# Altium schematic sheet CM4.SchDoc
size A3; SheetNumber: 3; SheetTotal: 10
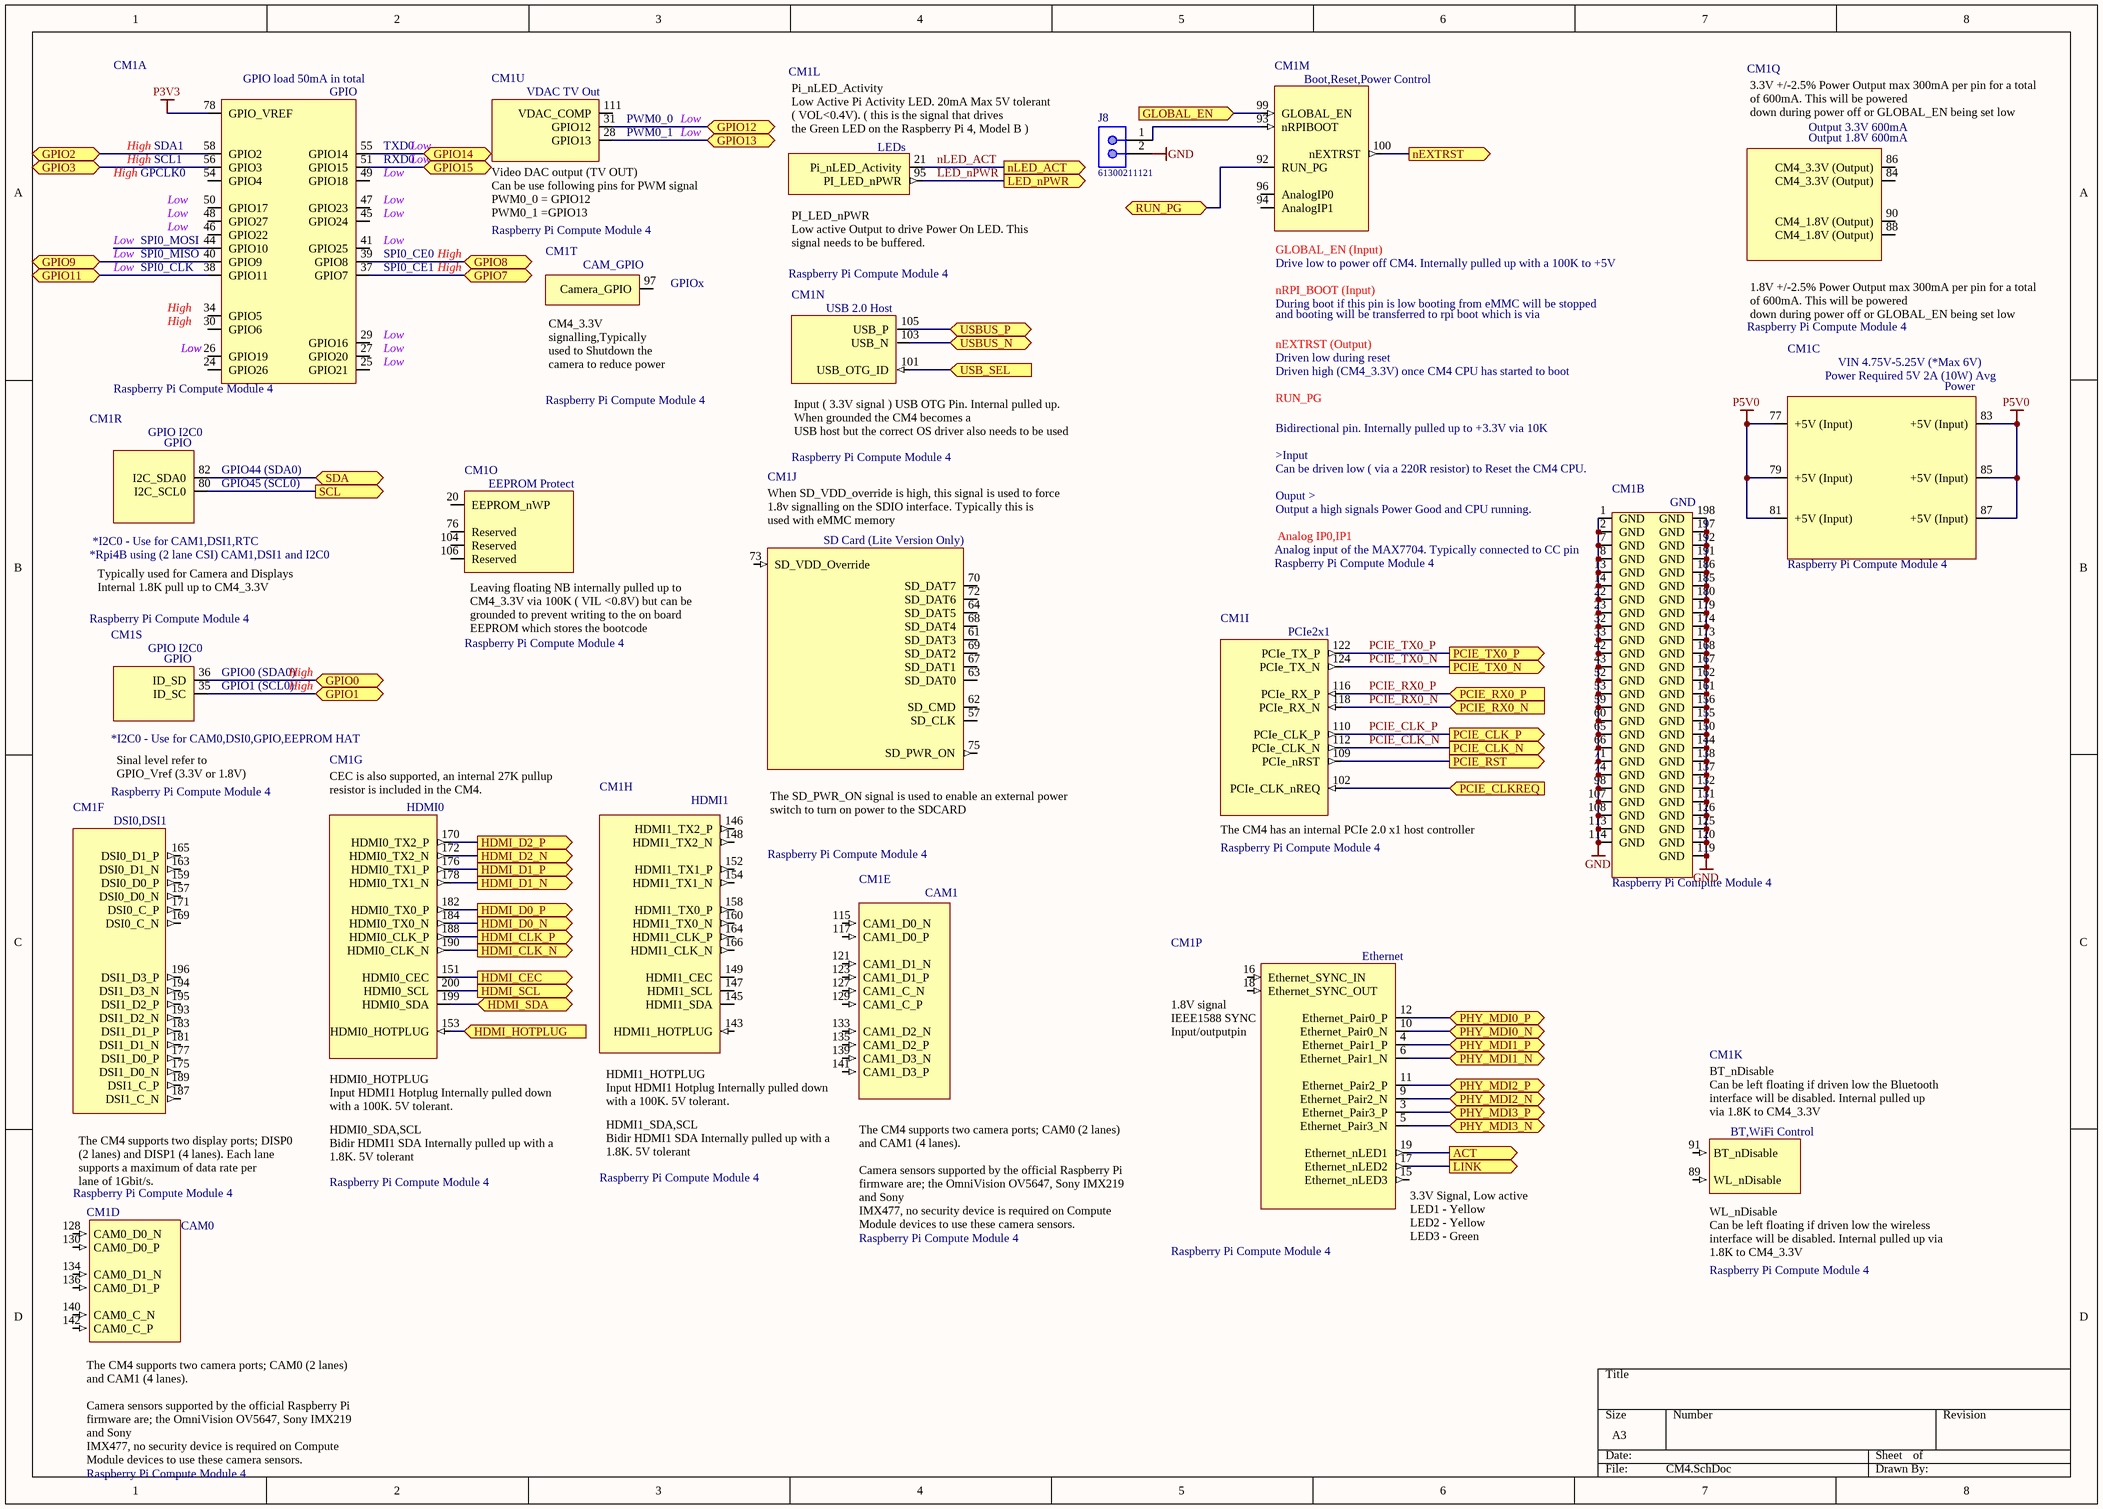
[diagram p0: CM4.SchDoc]

## Parts
CM1  Raspberry Pi Compute Module 4  [CM4-DF40HC(3.0)-100DS-0.4v_3mm_1.5mm]  (parts A,B,C,D,E,F,G,H,I,J,K,L,M,N,O,P,Q,R,S,T,U of 21)  (no BOM)
J8  61300211121  [61300211121]

## Ports
ACT (out), GLOBAL_EN (in), GPIO0 (bidir), GPIO1 (bidir), GPIO2 (bidir), GPIO3 (bidir), GPIO7 (bidir), GPIO8 (bidir), GPIO9 (bidir), GPIO11 (bidir), GPIO12 (bidir), GPIO13 (bidir), GPIO14 (bidir), GPIO15 (bidir), HDMI_CEC (out), HDMI_CLK_N (out), HDMI_CLK_P (out), HDMI_D0_N (out), HDMI_D0_P (out), HDMI_D1_N (out), HDMI_D1_P (out), HDMI_D2_N (out), HDMI_D2_P (out), HDMI_HOTPLUG (in), HDMI_SCL (out), HDMI_SDA (bidir), LED_nPWR (out), LINK (out), nEXTRST (out), nLED_ACT (out), PCIE_CLK_N (out), PCIE_CLK_P (out), PCIE_CLKREQ (in), PCIE_RST (out), PCIE_RX0_N (in), PCIE_RX0_P (in), PCIE_TX0_N (out), PCIE_TX0_P (out), PHY_MDI0_N (bidir), PHY_MDI0_P (bidir), PHY_MDI1_N (bidir), PHY_MDI1_P (bidir), PHY_MDI2_N (bidir), PHY_MDI2_P (bidir), PHY_MDI3_N (bidir), PHY_MDI3_P (bidir), RUN_PG (bidir), SCL (out), SDA (bidir), USB_SEL (in), USBUS_N (bidir), USBUS_P (bidir)

## Nets
GND: CM1.1(GND) CM1.2(GND) CM1.7(GND) CM1.8(GND) CM1.13(GND) CM1.14(GND) CM1.22(GND) CM1.23(GND) CM1.32(GND) CM1.33(GND) CM1.42(GND) CM1.43(GND) CM1.52(GND) CM1.53(GND) CM1.59(GND) CM1.60(GND) CM1.65(GND) CM1.66(GND) CM1.71(GND) CM1.74(GND) CM1.98(GND) CM1.107(GND) CM1.108(GND) CM1.113(GND) CM1.114(GND) CM1.119(GND) CM1.120(GND) CM1.125(GND) CM1.126(GND) CM1.131(GND) CM1.132(GND) CM1.137(GND) CM1.138(GND) CM1.144(GND) CM1.150(GND) CM1.155(GND) CM1.156(GND) CM1.161(GND) CM1.162(GND) CM1.167(GND) CM1.168(GND) CM1.173(GND) CM1.174(GND) CM1.179(GND) CM1.180(GND) CM1.185(GND) CM1.186(GND) CM1.191(GND) CM1.192(GND) CM1.197(GND) CM1.198(GND) J8.2
P3V3: CM1.78(GPIO_VREF)
P5V0: CM1.77(+5V_(Input)) CM1.79(+5V_(Input)) CM1.81(+5V_(Input)) CM1.83(+5V_(Input)) CM1.85(+5V_(Input)) CM1.87(+5V_(Input))
ACT: CM1.19(Ethernet_nLED1) ; port ACT
GLOBAL_EN: CM1.99(GLOBAL_EN) ; port GLOBAL_EN
GPIO0: CM1.36(ID_SD) ; port GPIO0
GPIO1: CM1.35(ID_SC) ; port GPIO1
GPIO2: CM1.58(GPIO2) ; port GPIO2
GPIO3: CM1.56(GPIO3) ; port GPIO3
GPIO7: CM1.37(GPIO7) ; port GPIO7
GPIO8: CM1.39(GPIO8) ; port GPIO8
GPIO9: CM1.40(GPIO9) ; port GPIO9
GPIO11: CM1.38(GPIO11) ; port GPIO11
GPIO12: CM1.31(GPIO12) ; port GPIO12
GPIO13: CM1.28(GPIO13) ; port GPIO13
GPIO14: CM1.55(GPIO14) ; port GPIO14
GPIO15: CM1.51(GPIO15) ; port GPIO15
HDMI_CEC: CM1.151(HDMI0_CEC) ; port HDMI_CEC
HDMI_CLK_N: CM1.190(HDMI0_CLK_N) ; port HDMI_CLK_N
HDMI_CLK_P: CM1.188(HDMI0_CLK_P) ; port HDMI_CLK_P
HDMI_D0_N: CM1.184(HDMI0_TX0_N) ; port HDMI_D0_N
HDMI_D0_P: CM1.182(HDMI0_TX0_P) ; port HDMI_D0_P
HDMI_D1_N: CM1.178(HDMI0_TX1_N) ; port HDMI_D1_N
HDMI_D1_P: CM1.176(HDMI0_TX1_P) ; port HDMI_D1_P
HDMI_D2_N: CM1.172(HDMI0_TX2_N) ; port HDMI_D2_N
HDMI_D2_P: CM1.170(HDMI0_TX2_P) ; port HDMI_D2_P
HDMI_HOTPLUG: CM1.153(HDMI0_HOTPLUG) ; port HDMI_HOTPLUG
HDMI_SCL: CM1.200(HDMI0_SCL) ; port HDMI_SCL
HDMI_SDA: CM1.199(HDMI0_SDA) ; port HDMI_SDA
LED_nPWR: CM1.95(PI_LED_nPWR) ; port LED_nPWR
LINK: CM1.17(Ethernet_nLED2) ; port LINK
nEXTRST: CM1.100(nEXTRST) ; port nEXTRST
nLED_ACT: CM1.21(Pi_nLED_Activity) ; port nLED_ACT
PCIE_CLK_N: CM1.112(PCIe_CLK_N) ; port PCIE_CLK_N
PCIE_CLK_P: CM1.110(PCIe_CLK_P) ; port PCIE_CLK_P
PCIE_CLKREQ: CM1.102(PCIe_CLK_nREQ) ; port PCIE_CLKREQ
PCIE_RST: CM1.109(PCIe_nRST) ; port PCIE_RST
PCIE_RX0_N: CM1.118(PCIe_RX_N) ; port PCIE_RX0_N
PCIE_RX0_P: CM1.116(PCIe_RX_P) ; port PCIE_RX0_P
PCIE_TX0_N: CM1.124(PCIe_TX_N) ; port PCIE_TX0_N
PCIE_TX0_P: CM1.122(PCIe_TX_P) ; port PCIE_TX0_P
PHY_MDI0_N: CM1.10(Ethernet_Pair0_N) ; port PHY_MDI0_N
PHY_MDI0_P: CM1.12(Ethernet_Pair0_P) ; port PHY_MDI0_P
PHY_MDI1_N: CM1.6(Ethernet_Pair1_N) ; port PHY_MDI1_N
PHY_MDI1_P: CM1.4(Ethernet_Pair1_P) ; port PHY_MDI1_P
PHY_MDI2_N: CM1.9(Ethernet_Pair2_N) ; port PHY_MDI2_N
PHY_MDI2_P: CM1.11(Ethernet_Pair2_P) ; port PHY_MDI2_P
PHY_MDI3_N: CM1.5(Ethernet_Pair3_N) ; port PHY_MDI3_N
PHY_MDI3_P: CM1.3(Ethernet_Pair3_P) ; port PHY_MDI3_P
RUN_PG: CM1.92(RUN_PG) ; port RUN_PG
SCL: CM1.80(I2C_SCL0) ; port SCL
SDA: CM1.82(I2C_SDA0) ; port SDA
USB_SEL: CM1.101(USB_OTG_ID) ; port USB_SEL
USBUS_N: CM1.103(USB_N) ; port USBUS_N
USBUS_P: CM1.105(USB_P) ; port USBUS_P
NetCM1_93: CM1.93(nRPIBOOT) J8.1

Not connected (* = marked no-connect by the designer): CM1 15(Ethernet_nLED3) 16(Ethernet_SYNC_IN) 18(Ethernet_SYNC_OUT) 20(EEPROM_nWP) 24(GPIO26) 25(GPIO21) 26(GPIO19) 27(GPIO20) 29(GPIO16) 30(GPIO6) 34(GPIO5) 41(GPIO25) 44(GPIO10) 45(GPIO24) 46(GPIO22) 47(GPIO23) 48(GPIO27) 49(GPIO18) 50(GPIO17) 54(GPIO4) 57(SD_CLK) 61(SD_DAT3) 62(SD_CMD) 63(SD_DAT0) 64(SD_DAT5) 67(SD_DAT1) 68(SD_DAT4) 69(SD_DAT2) 70(SD_DAT7) 72(SD_DAT6) 73(SD_VDD_Override) 75(SD_PWR_ON) 76(Reserved) 84(CM4_3.3V_(Output)) 86(CM4_3.3V_(Output)) 88(CM4_1.8V_(Output)) 89(WL_nDisable) 90(CM4_1.8V_(Output)) 91(BT_nDisable) 94(AnalogIP1) 96(AnalogIP0) 97(Camera_GPIO) 104(Reserved) 106(Reserved) 111(VDAC_COMP) 115(CAM1_D0_N) 117(CAM1_D0_P) 121(CAM1_D1_N) 123(CAM1_D1_P) 127(CAM1_C_N) 128(CAM0_D0_N) 129(CAM1_C_P) 130(CAM0_D0_P) 133(CAM1_D2_N) 134(CAM0_D1_N) 135(CAM1_D2_P) 136(CAM0_D1_P) 139(CAM1_D3_N) 140(CAM0_C_N) 141(CAM1_D3_P) 142(CAM0_C_P) 143(HDMI1_HOTPLUG) 145(HDMI1_SDA) 146(HDMI1_TX2_P) 147(HDMI1_SCL) 148(HDMI1_TX2_N) 149(HDMI1_CEC) 152(HDMI1_TX1_P) 154(HDMI1_TX1_N) 157(DSI0_D0_N) 158(HDMI1_TX0_P) 159(DSI0_D0_P) 160(HDMI1_TX0_N) 163(DSI0_D1_N) 164(HDMI1_CLK_P) 165(DSI0_D1_P) 166(HDMI1_CLK_N) 169(DSI0_C_N) 171(DSI0_C_P) 175(DSI1_D0_N) 177(DSI1_D0_P) 181(DSI1_D1_N) 183(DSI1_D1_P) 187(DSI1_C_N) 189(DSI1_C_P) 193(DSI1_D2_N) 194(DSI1_D3_N) 195(DSI1_D2_P) 196(DSI1_D3_P)

## Notes on the sheet
- (in symbol CM4, part A) GPIO load 50mA in total; GPIO; High; SDA1; TXD0; Low; SCL1; RXD0; GPCLK0; SPI0_MOSI; SPI0_MISO; SPI0_CE0; SPI0_CLK; SPI0_CE1; by Amornthep Phunsin
- (in symbol CM4, part C) VIN 4.75V-5.25V (*Max 6V); Power Required 5V 2A (10W) Avg; Power; by Amornthep Phunsin
- (in symbol CM4, part D) CAM0; The CM4 supports two camera ports; CAM0 (2 lanes) and CAM1 (4 lanes). / Camera sensors supported by the official Raspberry Pi firmware are; the OmniVision OV5647, Sony IMX219 and Sony / IMX477, no security device is required on Compute Module devices to use these camera sensors.
- (in symbol CM4, part E) CAM1; The CM4 supports two camera ports; CAM0 (2 lanes) and CAM1 (4 lanes). / Camera sensors supported by the official Raspberry Pi firmware are; the OmniVision OV5647, Sony IMX219 and Sony / IMX477, no security device is required on Compute Module devices to use these camera sensors.
- (in symbol CM4, part F) DSI0,DSI1; The CM4 supports two display ports; DISP0 (2 lanes) and DISP1 (4 lanes). Each lane supports a maximum of data rate per / lane of 1Gbit/s.
- (in symbol CM4, part G) HDMI0; CEC is also supported, an internal 27K pullup resistor is included in the CM4.; HDMI0_HOTPLUG / Input HDMI1 Hotplug Internally pulled down with a 100K. 5V tolerant.; HDMI0_SDA,SCL / Bidir HDMI1 SDA Internally pulled up with a 1.8K. 5V tolerant
- (in symbol CM4, part H) HDMI1; HDMI1_HOTPLUG / Input HDMI1 Hotplug Internally pulled down with a 100K. 5V tolerant.; HDMI1_SDA,SCL / Bidir HDMI1 SDA Internally pulled up with a 1.8K. 5V tolerant
- (in symbol CM4, part I) PCIe2x1; The CM4 has an internal PCIe 2.0 x1 host controller
- (in symbol CM4, part J) When SD_VDD_override is high, this signal is used to force 1.8v signalling on the SDIO interface. Typically this is / used with eMMC memory; SD Card (Lite Version Only); by Amornthep Phunsin; The SD_PWR_ON signal is used to enable an external power switch to turn on power to the SDCARD
- (in symbol CM4, part K) BT_nDisable / Can be left floating if driven low the Bluetooth interface will be disabled. Internal pulled up / via 1.8K to CM4_3.3V; BT,WiFi Control; WL_nDisable / Can be left floating if driven low the wireless interface will be disabled. Internal pulled up via / 1.8K to CM4_3.3V
- (in symbol CM4, part L) Pi_nLED_Activity / Low Active Pi Activity LED. 20mA Max 5V tolerant ( VOL<0.4V). ( this is the signal that drives / the Green LED on the Raspberry Pi 4, Model B ); LEDs; PI_LED_nPWR / Low active Output to drive Power On LED. This signal needs to be buffered.
- (in symbol CM4, part M) Boot,Reset,Power Control; GLOBAL_EN (Input); Drive low to power off CM4. Internally pulled up with a 100K to +5V; nRPI_BOOT (Input); During boot if this pin is low booting from eMMC will be stopped; and booting will be transferred to rpi boot which is via; nEXTRST (Output); Driven low during reset; Driven high (CM4_3.3V) once CM4 CPU has started to boot; Bidirectional pin. Internally pulled up to +3.3V via 10K / >Input / Can be driven low ( via a 220R resistor) to Reset the CM4 CPU. / Ouput > / Output a high signals Power Good and CPU running.; Analog IP0,IP1; Analog input of the MAX7704. Typically connected to CC pin
- (in symbol CM4, part N) USB 2.0 Host; Input ( 3.3V signal ) USB OTG Pin. Internal pulled up. When grounded the CM4 becomes a / USB host but the correct OS driver also needs to be used
- (in symbol CM4, part O) EEPROM Protect; Leaving floating NB internally pulled up to CM4_3.3V via 100K ( VIL <0.8V) but can be / grounded to prevent writing to the on board EEPROM which stores the bootcode
- (in symbol CM4, part P) Ethernet; 1.8V signal / IEEE1588 SYNC Input/outputpin; by Amornthep Phunsin; 3.3V Signal, Low active / LED1 - Yellow / LED2 - Yellow / LED3 - Green
- (in symbol CM4, part Q) 3.3V +/-2.5% Power Output max 300mA per pin for a total of 600mA. This will be powered / down during power off or GLOBAL_EN being set low; Output 3.3V 600mA; Output 1.8V 600mA; 1.8V +/-2.5% Power Output max 300mA per pin for a total of 600mA. This will be powered / down during power off or GLOBAL_EN being set low
- (in symbol CM4, part R) GPIO I2C0; GPIO; GPIO44 (SDA0); GPIO45 (SCL0); *I2C0 - Use for CAM1,DSI1,RTC; *Rpi4B using (2 lane CSI) CAM1,DSI1 and I2C0; Typically used for Camera and Displays Internal 1.8K pull up to CM4_3.3V
- (in symbol CM4, part S) GPIO I2C0; GPIO; GPIO0 (SDA0); High; GPIO1 (SCL0); *I2C0 - Use for CAM0,DSI0,GPIO,EEPROM HAT; Sinal level refer to  GPIO_Vref (3.3V or 1.8V)
- (in symbol CM4, part T) CAM_GPIO; GPIOx; CM4_3.3V signalling,Typically used to Shutdown the camera to reduce power
- (in symbol CM4, part U) VDAC TV Out; PWM0_0; Low; PWM0_1; Video DAC output (TV OUT) / Can be use following pins for PWM signal / PWM0_0 = GPIO12 / PWM0_1 =GPIO13

## Library data of the parts
CM1 = CM4: Raspberry Pi Compute Module 4 by Amornthep Phunsin
J8 = 61300211121: WR-PHD Pin Header, THT, pitch 2.54mm, Single Row, Vertical, 2pin; Pin Number: 2; Gender: Male; Rated Current: 3A; Working Voltage: 250VAC; Withstanding Voltage: 500VAC; Contact Resistance: 20mOhm; ComponentLink1Description: Manufacturer; ComponentLink1URL: http://www.we-online.de; ComponentLink2Description: Datasheet; ComponentLink2URL: https://katalog.we-online.de/em/datasheet/6130xx11121.pdf; Part Number: 61300211121; Published Date: June 2019; Publisher: Wurth Elektronik; Pitch: 2.54mm; Operating Temperature: -40 to +105degC; Mounting Technology: THT; Packaging: Bag; Row Number: Single; Orientation: Vertical